# Altium schematic sheet DSS2_JoystickController.SchDoc
size A4; CompanyName: HESSO; Address1: Route du Rawyl 47; Address2: 1950 Sion; Address3: Switzerland; SheetNumber: 1; SheetTotal: 1; PageSetup: Record=PageOptions|CenterHorizontal=True|CenterVertical=True|PrintScale=1.00|XCorrection=1.00|YCorrection=1.00|PrintKind=1|BorderSize=5000000|LeftOffset=0|BottomOffset=0|Orientation=2|PaperLength=1000|PaperWidth=1000|Scale=100|PaperSource=15|PrintQuality=1200|MediaType=1|DitherType=10|PrintScaleMode=1|PaperKind=A4|PaperIndex=9; ProjectName: Project Name
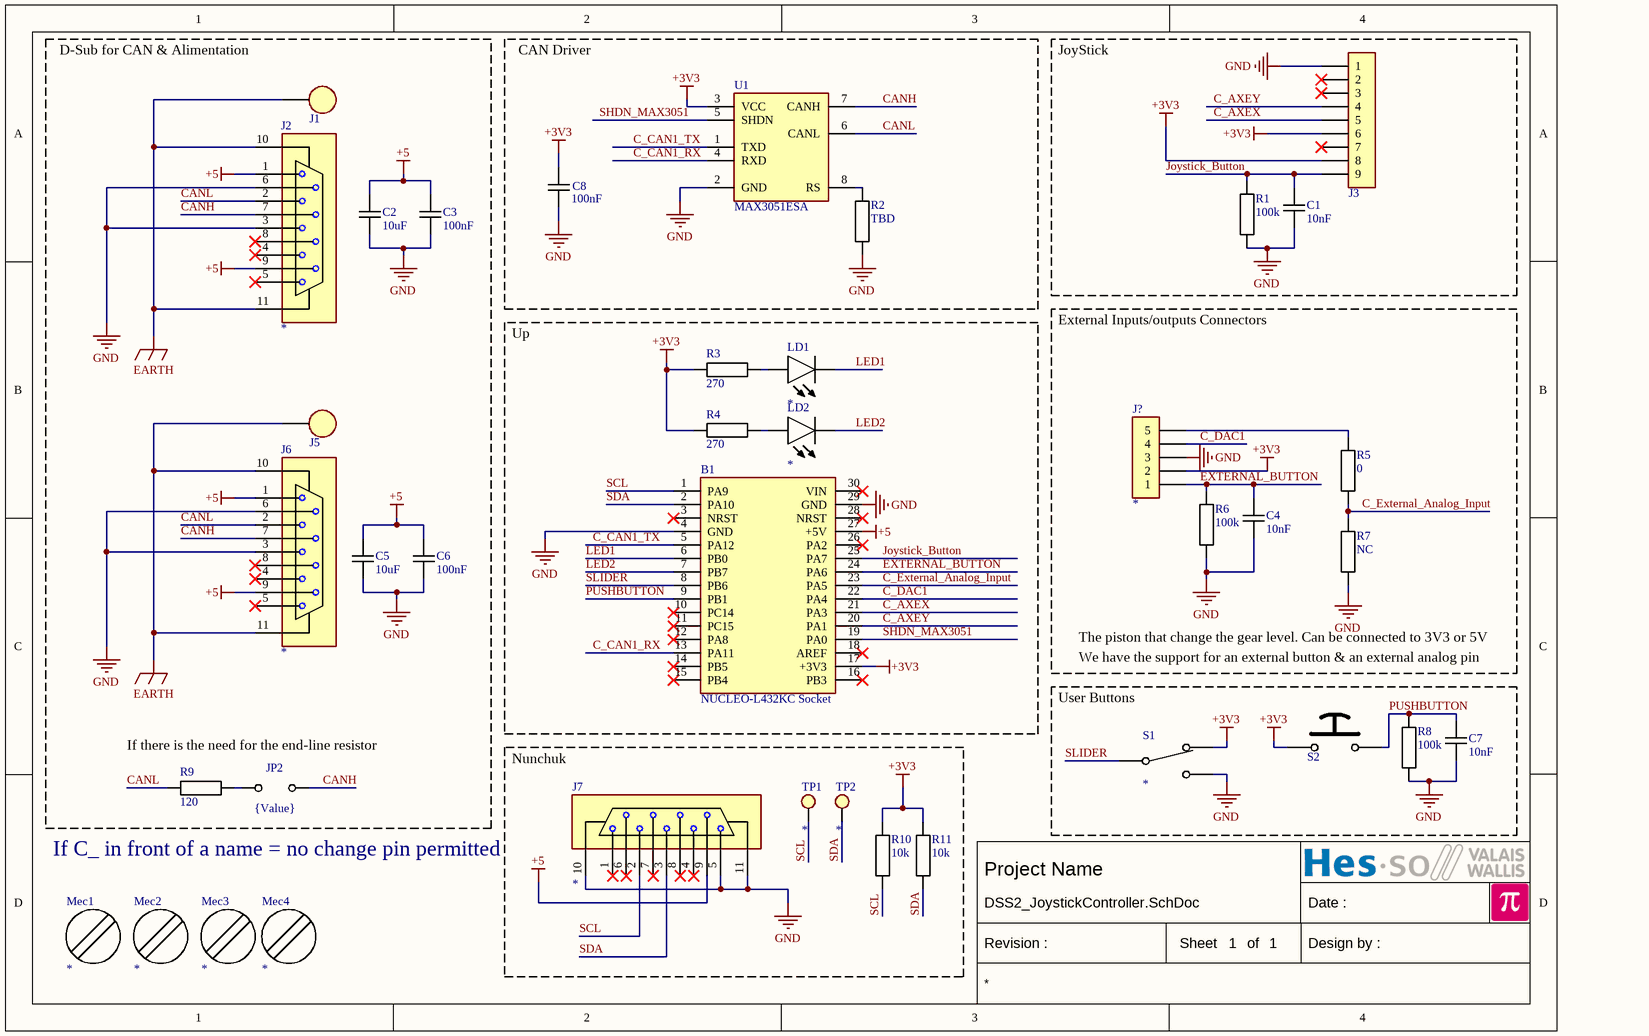
[diagram p0: DSS2_JoystickController.SchDoc]

## Parts
B1  NUCLEO-L432KC Socket  [NUCLEO-L432KC Socket]
C1  10nF  [CAPACITOR 2012 REFLOW]
C2  10uF  [CAPACITOR 2012 REFLOW]
C3  100nF  [CAPACITOR 2012 REFLOW]
C4  10nF  [CAPACITOR 2012 REFLOW]
C5  10uF  [CAPACITOR 2012 REFLOW]
C6  100nF  [CAPACITOR 2012 REFLOW]
C7  10nF  [CAPACITOR 2012 REFLOW]
C8  100nF  [CAPACITOR 2012 REFLOW]
J1  3867B.68  [FASTON 6.3mm P5.0]  (value not drawn)
J2  *  [D-SUB 9 FEM RND 205-00769]
J3  *  [PinHeader1x9 P2.54]  (value not drawn)
J5  3867B.68  [FASTON 6.3mm P5.0]  (value not drawn)
J6  *  [D-SUB 9 FEM RND 205-00769]
J7  *  [D-SUB 9 FEM RND 205-00769]
J?  *  [ScrewHeader5 P5.0]
JP2  {Value}  [JUMPER2 TH]
LD1  *  [LED 2012 REFLOW]
LD2  *  [LED 2012 REFLOW]
Mec1  *  [Screw M3X5 Unconnected]
Mec2  *  [Screw M3X5 Unconnected]
Mec3  *  [Screw M3X5 Unconnected]
Mec4  *  [Screw M3X5 Unconnected]
R1  100k  [RESISTOR 2012 REFLOW]
R2  TBD  [RESISTOR 2012 REFLOW]
R3  270  [RESISTOR 2012 REFLOW]
R4  270  [RESISTOR 2012 REFLOW]
R5  0  [RESISTOR 2012 REFLOW]
R6  100k  [RESISTOR 2012 REFLOW]
R7  NC  [RESISTOR 2012 REFLOW]
R8  100k  [RESISTOR 2012 REFLOW]
R9  120  [RESISTOR 2012 REFLOW]
R10  10k  [RESISTOR 2012 REFLOW]
R11  10k  [RESISTOR 2012 REFLOW]
S1  *  [SLIDE SWITCH Knitter MFP120]
S2  *  [Push Button C2.5X3.0 OMRON B3U-1000P(M)-B]  (value not drawn)
TP1  *  [Hole 0.8 D1.5]  (no BOM)
TP2  *  [Hole 0.8 D1.5]  (no BOM)
U1  MAX3051ESA  [SO8 P1.27 C4.0X5.0 H1.75]

## Blocks framed on the sheet
CAN Driver: C8 R2 U1
JoyStick: C1 J3 R1
Up: B1 LD1 LD2 R3 R4
External Inputs/outputs Connectors: C4 J? R5-R7
User Buttons: C7 R8 S1 S2
Nunchuk: J7 R10 R11 TP1 TP2

## Nets
+3V3: B1.17(+3V3) C8.2 J3.6 J3.8 J?.2 R3.2 R4.2 R10.2 R11.2 S1.1(NC) S2.1 U1.3(VCC)
+5: B1.27(+5V) C2.2 C3.2 C5.2 C6.2 J2.1 J2.9 J6.1 J6.9 J7.9
EARTH: J1.1 J2.10 J2.11 J5.1 J6.10 J6.11
GND: B1.4(GND) B1.29(GND) C1.1 C2.1 C3.1 C4.1 C5.1 C6.1 C7.1 C8.1 J2.3 J2.6 J3.1 J6.3 J6.6 J7.5 J7.10 J7.11 J?.3 R1.1 R2.1 R6.1 R7.1 R8.1 S1.3(NO) U1.2(GND)
C_AXEX: B1.21(PA3) J3.5
C_AXEY: B1.20(PA1) J3.4
C_CAN1_RX: B1.13(PA11) U1.4(RXD)
C_CAN1_TX: B1.5(PA12) U1.1(TXD)
C_DAC1: B1.22(PA4) J?.4
C_External_Analog_Input: B1.23(PA5) R5.1 R7.2
CANH: J2.7 J6.7 JP2.2 U1.7(CANH)
CANL: J2.2 J6.2 R9.1 U1.6(CANL)
EXTERNAL_BUTTON: B1.24(PA6) C4.2 J?.1 R6.2
Joystick_Button: B1.25(PA7) C1.2 J3.9 R1.2
LED1: B1.6(PB0) LD1.1(C)
LED2: B1.7(PB7) LD2.1(C)
PUSHBUTTON: B1.9(PB1) C7.2 R8.2 S2.2
SCL: B1.1(PA9) J7.2 R10.1 TP1.1
SDA: B1.2(PA10) J7.3 R11.1 TP2.1
SHDN_MAX3051: B1.19(PA0) U1.5(SHDN)
SLIDER: B1.8(PB6) S1.2(com)
NetJ?_5: J?.5 R5.2
NetJP2_1: JP2.1 R9.2
NetLD1_2: LD1.2(A) R3.1
NetLD2_2: LD2.2(A) R4.1
NetR2_2: R2.2 U1.8(RS)

Not connected (* = marked no-connect by the designer): B1 3(NRST)* 10(PC14)* 11(PC15)* 12(PA8)* 14(PB5)* 15(PB4)* 16(PB3)* 18(AREF)* 26(PA2)* 28(NRST)* 30(VIN)*; J2 4* 5* 8*; J3 2* 3* 7*; J6 4* 5* 8*; J7 1* 4* 6* 7* 8*

## Notes on the sheet
- D-Sub for CAN & Alimentation
- The piston that change the gear level. Can be connected to 3V3 or 5V
- We have the support for an external button & an external analog pin
- If there is the need for the end-line resistor
- (near J7) If C_ in front of a name = no change pin permitted
- Date :
- Revision :
- Sheet
- of
- Design by :

## Library data of the parts
B1 = NUCLEO-L432KC Socket: ARM Cortex based board; Value: NUCLEO-L432KC Socket
C1-C8 = Capacitor
  C1 C4 C7: Value: 10nF
  C2 C5: Value: 10uF
  C3 C6 C8: Value: 100nF
J1 J5 = FASTON 6.3mm P5.0: Faston Right angle Vogt 3867B.68; Value: 3867B.68
J2 J6 J7 = D-SUB 9 FEM GROUNDED: D-Subminiature 9 way Socket Right Angle; Value: *
J3 = PinHeader1x9: Plug connector; Value: *
J? = Header5: PCB terminal block; Value: *
JP2 = JUMPER 2 POS: Value: {Value}
LD1 LD2 = LED: LED generic; Value: *
Mec1-Mec4 = Screw Unconnected: Screw Unconnected BN330; Value: *
R1-R11 = Resistor
  R1 R6 R8: Value: 100k
  R2: Value: TBD
  R3 R4: Value: 270
  R5: Value: 0
  R7: Value: NC
  R9: Value: 120
  R10 R11: Value: 10k
S1 = Slide Switch 1Pole ON-ON: Value: *
S2 = Push Button 2Pins: Push Button, 2 pins; Value: *
TP1 TP2 = Hole: Value: *
U1 = MAX3051ESA: +3.3V, 1Mbps, Low-Supply-Current CAN Transceiver; Value: MAX3051ESA